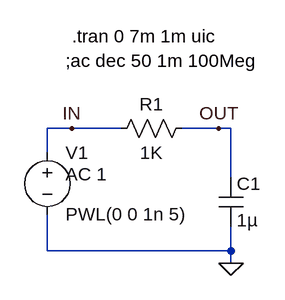
[diagram p0: schematic RC.asc]
RC.asc, the LTspice schematic file:
Version 4
SHEET 1 880 680
WIRE 112 -352 80 -352
WIRE 176 -352 112 -352
WIRE 304 -352 256 -352
WIRE 320 -352 304 -352
WIRE 80 -320 80 -352
WIRE 320 -288 320 -352
WIRE 80 -192 80 -240
WIRE 320 -192 320 -224
WIRE 320 -192 80 -192
WIRE 320 -176 320 -192
FLAG 320 -176 0
FLAG 112 -352 IN
FLAG 304 -352 OUT
SYMBOL res 272 -368 R90
WINDOW 0 0 56 VBottom 2
WINDOW 3 32 56 VTop 2
SYMATTR InstName R1
SYMATTR Value 1K
SYMBOL cap 304 -288 R0
SYMATTR InstName C1
SYMATTR Value 1µ
SYMBOL voltage 80 -336 R0
WINDOW 123 24 44 Left 2
WINDOW 39 0 0 Left 0
SYMATTR InstName V1
SYMATTR Value PWL(0 0 1n 5)
SYMATTR Value2 AC 1
TEXT 112 -472 Left 2 !.tran 0 7m 1m uic
TEXT 104 -440 Left 2 !;ac dec 50 1m 100Meg

The netlist it stands for:
* RC.asc
R1 OUT IN 1K
C1 OUT 0 1µ
V1 IN 0 PWL(0 0 1n 5) AC 1
.tran 0 7m 1m uic
;ac dec 50 1m 100Meg
.backanno
.end